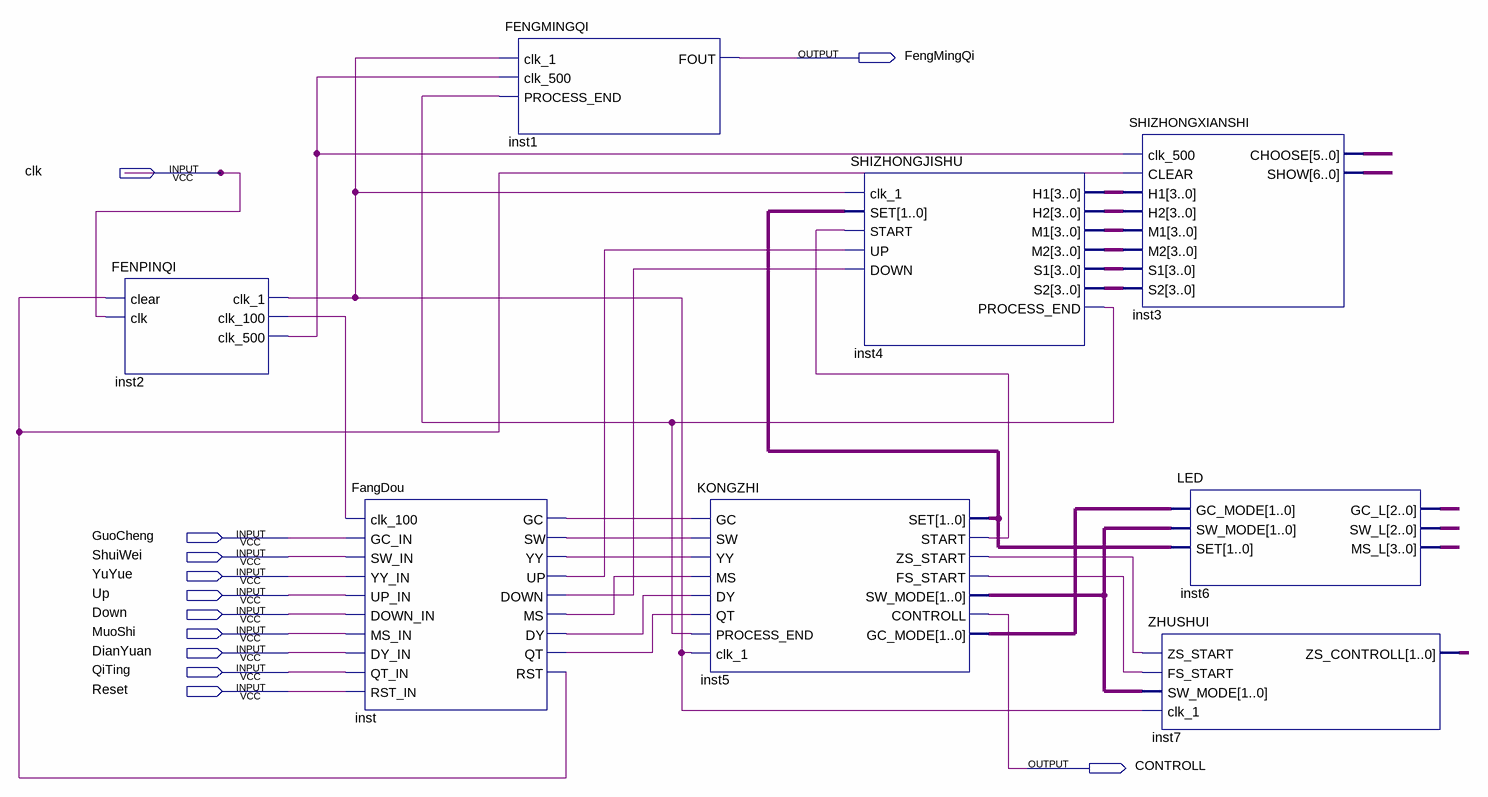
[diagram p0: schematic sheet]
// Quartus schematic TOP.bdf as structural Verilog: 8 symbols, 12 pins
module TOP (
  input  clk,
  input  GuoCheng,
  input  ShuiWei,
  input  YuYue,
  input  Up,
  input  Down,
  input  MuoShi,
  input  DianYuan,
  input  QiTing,
  input  Reset,
  output FengMingQi,
  output CONTROLL
);

  wire inst2_clk_1, inst2_clk_100, inst2_clk_500, inst4_process_end, inst5_fs_start, inst5_start,
       inst5_zs_start, inst_down, inst_dy, inst_gc, inst_ms, inst_qt, inst_rst, inst_sw, inst_up, inst_yy;
  wire [1:0] inst5_gc_mode, inst5_set, inst5_sw_mode, inst7_zs_controll;
  wire [2:0] inst6_gc_l, inst6_sw_l;
  wire [3:0] inst4_h1, inst4_h2, inst4_m1, inst4_m2, inst4_s1, inst4_s2, inst6_ms_l;
  wire [5:0] inst3_choose;
  wire [6:0] inst3_show;

  FENPINQI inst2 (.clear(inst_rst), .clk(clk), .clk_1(inst2_clk_1), .clk_100(inst2_clk_100), .clk_500(inst2_clk_500));
  FangDou inst (
    .clk_100(inst2_clk_100), .GC_IN(GuoCheng), .SW_IN(ShuiWei), .YY_IN(YuYue), .UP_IN(Up), .DOWN_IN(Down),
    .MS_IN(MuoShi), .DY_IN(DianYuan), .QT_IN(QiTing), .RST_IN(Reset), .GC(inst_gc), .SW(inst_sw),
    .YY(inst_yy), .UP(inst_up), .DOWN(inst_down), .MS(inst_ms), .DY(inst_dy), .QT(inst_qt), .RST(inst_rst));
  FENGMINGQI inst1 (.clk_1(inst2_clk_1), .clk_500(inst2_clk_500), .PROCESS_END(inst4_process_end), .FOUT(FengMingQi));
  KONGZHI inst5 (
    .GC(inst_gc), .SW(inst_sw), .YY(inst_yy), .MS(inst_ms), .DY(inst_dy), .QT(inst_qt),
    .PROCESS_END(inst4_process_end), .clk_1(inst2_clk_1), .SET(inst5_set), .START(inst5_start),
    .ZS_START(inst5_zs_start), .FS_START(inst5_fs_start), .SW_MODE(inst5_sw_mode), .CONTROLL(CONTROLL),
    .GC_MODE(inst5_gc_mode));
  SHIZHONGJISHU inst4 (
    .clk_1(inst2_clk_1), .SET(inst5_set), .START(inst5_start), .UP(inst_up), .DOWN(inst_down), .H1(inst4_h1),
    .H2(inst4_h2), .M1(inst4_m1), .M2(inst4_m2), .S1(inst4_s1), .S2(inst4_s2), .PROCESS_END(inst4_process_end));
  SHIZHONGXIANSHI inst3 (
    .clk_500(inst2_clk_500), .CLEAR(inst_rst), .H1(inst4_h1), .H2(inst4_h2), .M1(inst4_m1), .M2(inst4_m2),
    .S1(inst4_s1), .S2(inst4_s2), .CHOOSE(inst3_choose), .SHOW(inst3_show));
  ZHUSHUI inst7 (
    .ZS_START(inst5_zs_start), .FS_START(inst5_fs_start), .SW_MODE(inst5_sw_mode), .clk_1(inst2_clk_1),
    .ZS_CONTROLL(inst7_zs_controll));
  LED inst6 (
    .GC_MODE(inst5_gc_mode), .SW_MODE(inst5_sw_mode), .SET(inst5_set), .GC_L(inst6_gc_l), .SW_L(inst6_sw_l),
    .MS_L(inst6_ms_l));
endmodule
